# Altium project 0704_Final.PrjPcb
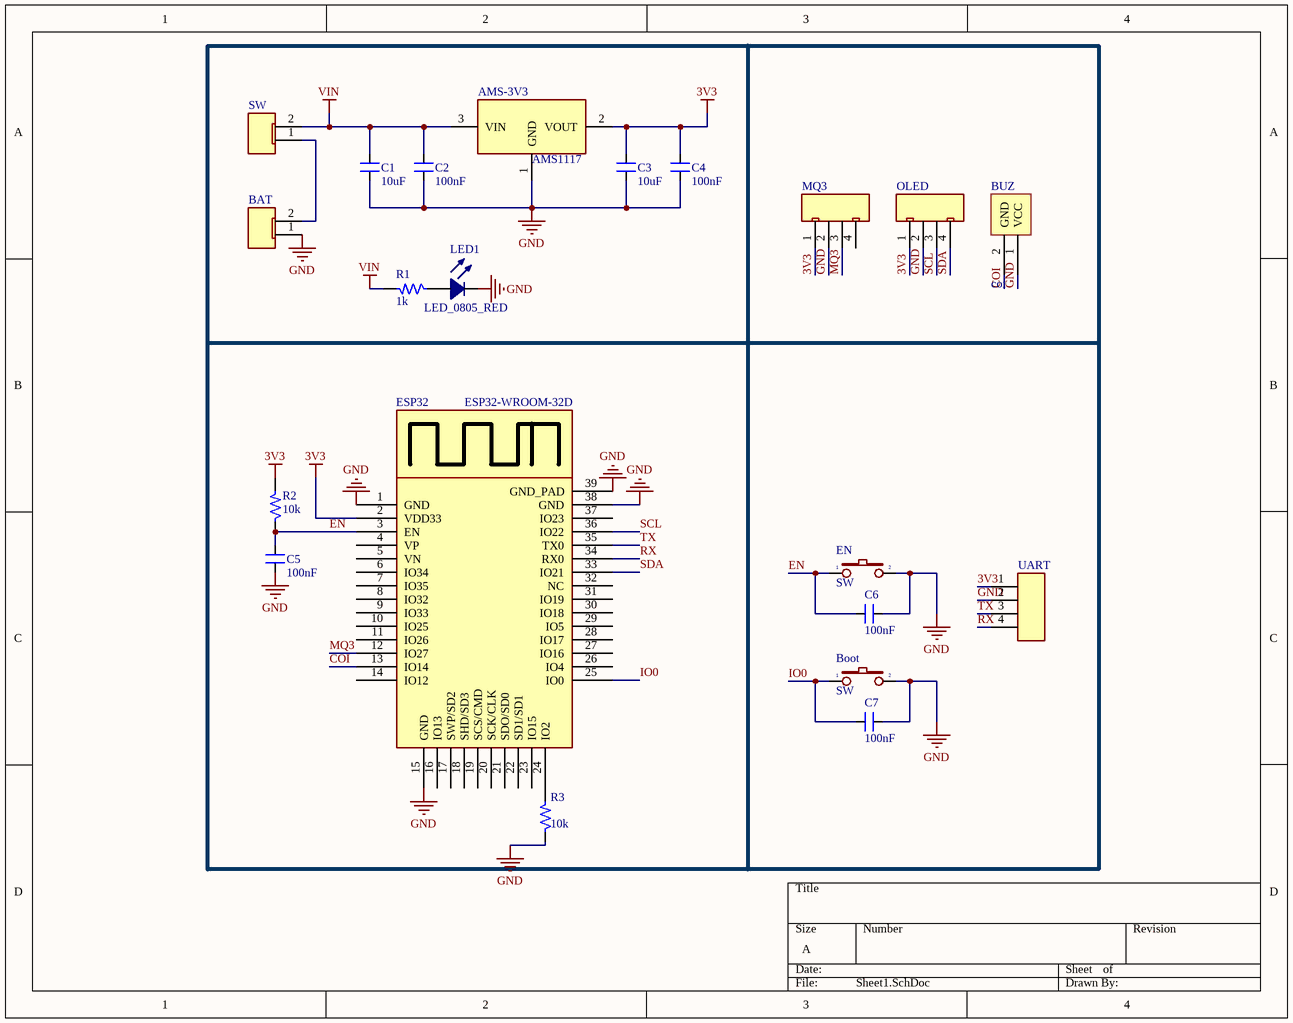
[diagram p0: Sheet1.SchDoc]
1 sheet, 21 parts. Net scope: global (net labels, ports and power ports of the same name join across sheets).
Board file: PCB2.PcbDoc

## Sheet Sheet1.SchDoc
size A; SheetNumber: 1; SheetTotal: 1

### Parts
AMS-3V3  AMS1117  [AMS1117]
BAT  JST-2.00-2P  [JST-2.00-2P]  (value not drawn)
Boot  SW  [SW2]
BUZ  coi  [Buzzer]
C1  10uF  [SM-1206]
C2  100nF  [SM-1206]
C3  10uF  [SM-1206]
C4  100nF  [SM-1206]
C5  100nF  [SM-1206]
C6  100nF  [SM-1206]
C7  100nF  [SM-1206]
EN  SW  [SW2]
ESP32  ESP32-WROOM-32D  [ESP32-WROOM-32D]
LED1  LED_0805_RED  [LED_0805_RED]
MQ3  JST-2.00-4P  [JST-2.00-4P]  (value not drawn)
OLED  JST-2.00-4P  [JST-2.00-4P]  (value not drawn)
R1  1k  [SM-1206]
R2  10k  [SM-1206]
R3  10k  [SM-1206]
SW  JST-2.00-2P  [JST-2.00-2P]  (value not drawn)
UART  MALE-2.54-4P  [MALE-2.54-4P]  (value not drawn)

### Nets
3V3: AMS-3V3.2(VOUT) C3.1 C4.1 ESP32.2(VDD33) MQ3.1 OLED.1 R2.2 UART.1
GND: AMS-3V3.1(GND) BAT.1 Boot.2 BUZ.1(VCC) C1.2 C2.2 C3.2 C4.2 C5.2 C6.1 C7.1 EN.2 ESP32.1(GND) ESP32.15(GND) ESP32.38(GND) ESP32.39(GND_PAD) LED1.2 MQ3.2 OLED.2 R3.1 UART.2
VIN: AMS-3V3.3(VIN) C1.1 C2.1 R1.2 SW.2
COI: BUZ.2(GND) ESP32.13(IO14)
EN: C5.1 C6.2 EN.1 ESP32.3(EN) R2.1
IO0: Boot.1 C7.2 ESP32.25(IO0)
MQ3: ESP32.12(IO27) MQ3.3
RX: ESP32.34(RX0) UART.4
SCL: ESP32.36(IO22) OLED.3
SDA: ESP32.33(IO21) OLED.4
TX: ESP32.35(TX0) UART.3
NetBAT_2: BAT.2 SW.1
NetESP32_24: ESP32.24(IO2) R3.2
NetLED1_1: LED1.1 R1.1

Not connected (* = marked no-connect by the designer): ESP32 4(VP) 5(VN) 6(IO34) 7(IO35) 8(IO32) 9(IO33) 10(IO25) 11(IO26) 14(IO12) 16(IO13) 17(SWP/SD2) 18(SHD/SD3) 19(SCS/CMD) 20(SCK/CLK) 21(SDO/SD0) 22(SD1/SD1) 23(IO15) 26(IO4) 27(IO16) 28(IO17) 29(IO5) 30(IO18) 31(IO19) 32(NC) 37(IO23); MQ3 4

### Library data of the parts
AMS-3V3 = AMS1117: IC REG LINEAR 1A SOT-89-3L; ComponentLink1Description: Datasheet; ComponentLink1URL: http://www.advanced-monolithic.com/pdf/ds1117.pdf; Digikey PN: 4518-AMS1117-3.3CT-ND; JLCPCB PN: C963410
BAT SW = JST-2.00-2P: Female Connector JST 2 Vias, 2.00mm.; JLCPCB PN: C5175230
Boot EN = SW2: Switch button 2 pin; Value: SW chip 2 pin
BUZ = COI SFM27
C1-C7 = CM: Cap SMD; Value: 103
ESP32 = ESP32-WROOM-32D: Chip SMD 39 Pads Wifi 2.4GHz BLE 4.2 18x25.5mm w/ Antenna.; Mouser PN: ESP32-WROOM-32D-N4; Digikey PN: 1965-ESP32-WROOM-32D-N8CT-ND; ComponentLink1Description: Datasheet; ComponentLink1URL: https://www.mouser.com/datasheet/2/891/esp32_wroom_32d_esp32_wroom_32u_datasheet_en-1365844.pdf; JLCPCB PN: C82899
LED1 = LED_0805_RED: LED 0805 Red.; JLCPCB PN: C113551
MQ3 OLED = JST-2.00-4P: Female Connector JST 4 Vias, 2.00mm.; JLCPCB PN: C5175232
R1-R3 = R: Resistor 1/4W; Value: R1/4W - 1K
UART = MALE-2.54-4P: Male Header Connector 2.54mm 4 Pins.; JLCPCB PN: C492403